# Altium schematic sheet lv_controller.SchDoc
size A4; SheetNumber: 1; SheetTotal: 3; SPICEModelCacheMFLOWQJR: <root> / <DocumentId>MFLOWQJR</DocumentId> / <CacheFrame Number="0"> / <Model Name="skydiode" Kind="MDL"> / <Text>*Default Schottky Diode / *Schottky Diode Pinout: A,K / .MODEL SKYDIODE D(EG=0.69 XTI=2)</Text> / </Model> / </CacheFrame> / </root>
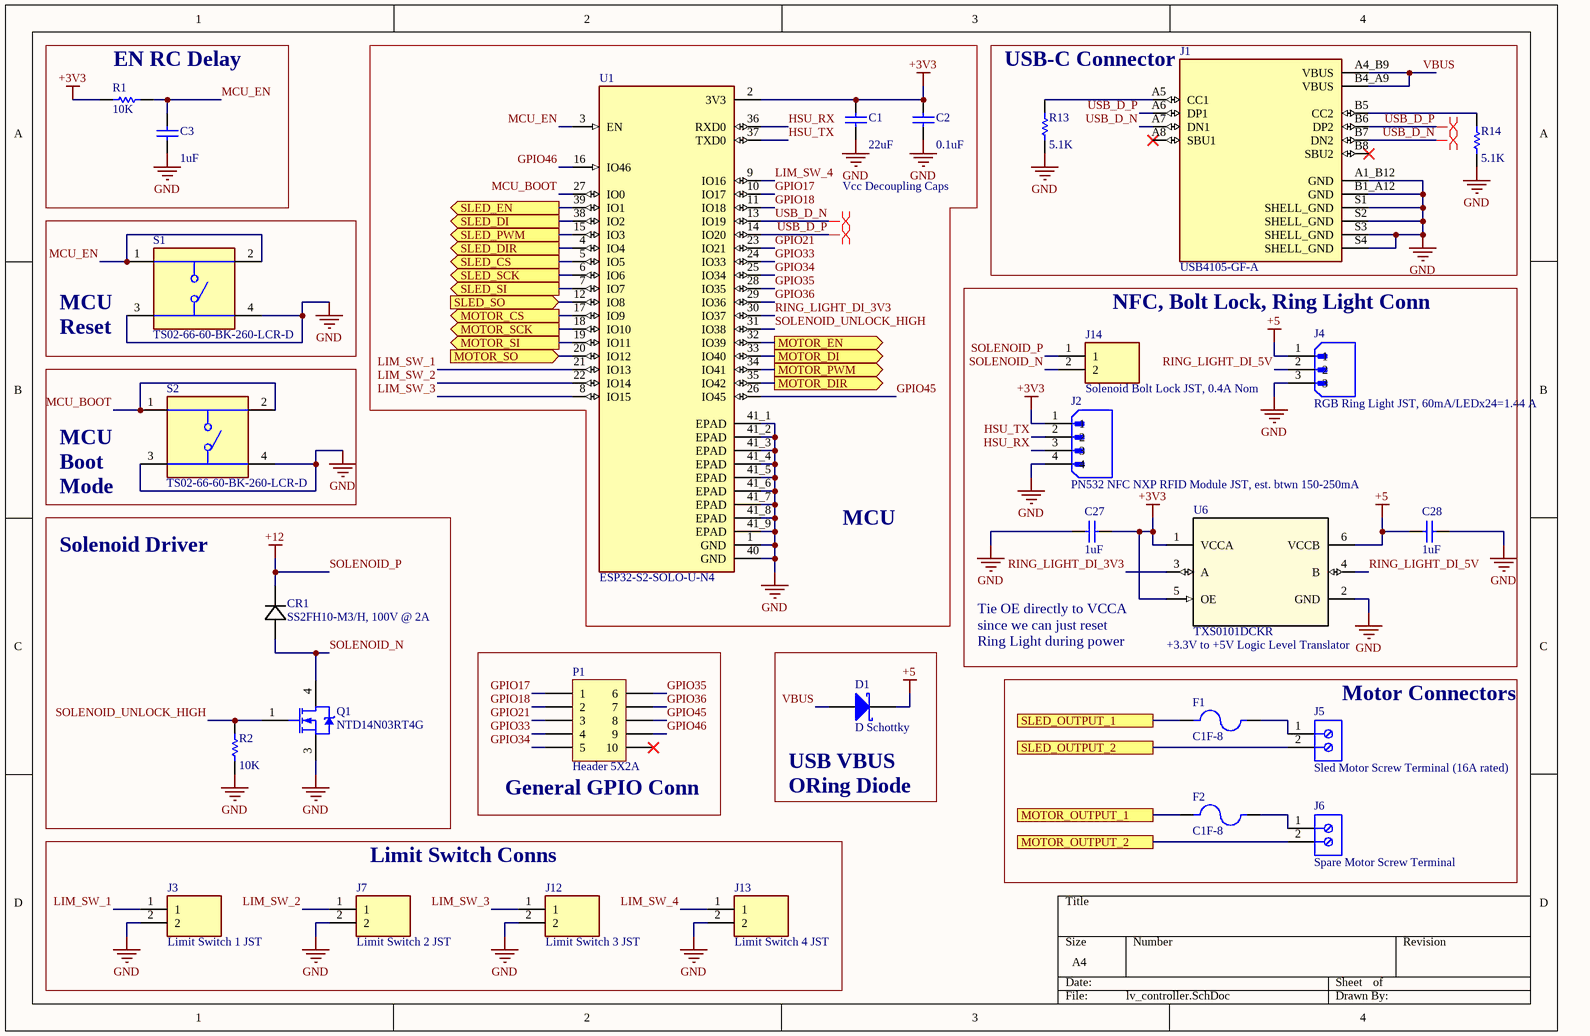
[diagram p0: lv_controller.SchDoc]

## Parts
C1  value 22uF  [C0805]  (hidden comment: Cap)
C2  value 0.1uF  [C0805]  (hidden comment: Cap)
C3  value 1uF  [C0805]  (hidden comment: Cap)
C27  value 1uF  [C0805]  (hidden comment: Cap)
C28  value 1uF  [C0805]  (hidden comment: Cap)
CR1  SS2FH10-M3/H, 100V @ 2A  [CR_10-M3/H_VIS]
D1  D Schottky  [SODFL4725X110N]
F1  C1F-8  [FUSC3215X83N]
F2  C1F-8  [FUSC3215X83N]
J1  USB4105-GF-A  [GCT_USB4105-GF-A]
J2  PN532 NFC NXP RFID Module JST, est. btwn 150-250mA  [JST_B4B-XH-A(LF)(SN)]
J3  Limit Switch 1 JST  [JST_B2B-XH-A(LF)(SN)]
J4  RGB Ring Light JST, 60mA/LEDx24=1.44 A  [JST_B3B-XH-A(LF)(SN)]
J5  Sled Motor Screw Terminal (16A rated)  [PHOE-1725656-2]
J6  Spare Motor Screw Terminal  [PHOE-1725656-2]
J7  Limit Switch 2 JST  [JST_B2B-XH-A(LF)(SN)]
J12  Limit Switch 3 JST  [JST_B2B-XH-A(LF)(SN)]
J13  Limit Switch 4 JST  [JST_B2B-XH-A(LF)(SN)]
J14  Solenoid Bolt Lock JST, 0.4A Nom  [JST_B2B-XH-A(LF)(SN)]
P1  Header 5X2A  [HDR2X5_CEN]
Q1  NTD14N03RT4G  [ONSC-DPAK-3-369C-01_V]
R1  value 10K  [6-0805_M]  (hidden comment: Res1)
R2  value 10K  [6-0805_M]  (hidden comment: Res1)
R13  value 5.1K  [6-0805_M]  (hidden comment: Res1)
R14  value 5.1K  [6-0805_M]  (hidden comment: Res1)
S1  TS02-66-60-BK-260-LCR-D  [SW_TS02-66-60-BK-260-LCR-D]
S2  TS02-66-60-BK-260-LCR-D  [SW_TS02-66-60-BK-260-LCR-D]
U1  ESP32-S2-SOLO-U-N4  [XCVR_ESP32-S2-SOLO-U-N4R2]
U6  TXS0101DCKR  [DCK0006A_N]

## Blocks framed on the sheet
EN RC Delay: C3 R1
MCU: C1 C2 U1
USB-C Connector: J1 R13 R14
NFC, Bolt Lock, Ring Light Conn: C27 C28 J2 J4 J14 U6
Solenoid Driver: CR1 Q1 R2
General GPIO Conn: P1
Motor Connectors: F1 F2 J5 J6
Limit Switch Conns: J3 J7 J12 J13

## Ports
MOTOR_CS (out, see lv_controller_motor_drivers[1C]), MOTOR_DI (out, see lv_controller_motor_drivers[1D]), MOTOR_DIR (out, see lv_controller_motor_drivers[1C]), MOTOR_EN (out, see lv_controller_motor_drivers[1C]), MOTOR_OUTPUT_1 (see lv_controller_motor_drivers[2C]), MOTOR_OUTPUT_2 (see lv_controller_motor_drivers[2C]), MOTOR_PWM (out, see lv_controller_motor_drivers[1C]), MOTOR_SCK (out, see lv_controller_motor_drivers[1C]), MOTOR_SI (out, see lv_controller_motor_drivers[1C]), MOTOR_SO (in, see lv_controller_motor_drivers[1C]), SLED_CS (out, see lv_controller_motor_drivers[2A]), SLED_DI (out, see lv_controller_motor_drivers[2B]), SLED_DIR (out, see lv_controller_motor_drivers[2B]), SLED_EN (out, see lv_controller_motor_drivers[2B]), SLED_OUTPUT_1 (see lv_controller_motor_drivers[4A]), SLED_OUTPUT_2 (see lv_controller_motor_drivers[4A]), SLED_PWM (out, see lv_controller_motor_drivers[2B]), SLED_SCK (out, see lv_controller_motor_drivers[2A]), SLED_SI (out, see lv_controller_motor_drivers[2A]), SLED_SO (in, see lv_controller_motor_drivers[2A])

## Nets
+3V3: C1.2 C2.2 C27.1 J2.1 R1.1 U1.2(3V3) U6.1(VCCA) U6.5(OE)
+5: C28.2 D1.2(K) J4.1 U6.6(VCCB)
GND: C1.1 C2.1 C3.1 C27.2 C28.1 J1.A1_B12(GND) J1.B1_A12(GND) J1.S1(SHELL_GND) J1.S2(SHELL_GND) J1.S3(SHELL_GND) J1.S4(SHELL_GND) J2.4 J3.2 J4.3 J7.2 J12.2 J13.2 Q1.3(S) R2.2 R13.1 R14.1 S1.3 S1.4 S2.3 S2.4 U1.1(GND) U1.40(GND) U1.41_1(EPAD) U1.41_2(EPAD) U1.41_3(EPAD) U1.41_4(EPAD) U1.41_5(EPAD) U1.41_6(EPAD) U1.41_7(EPAD) U1.41_8(EPAD) U1.41_9(EPAD) U6.2(GND)
SOLENOID_P: CR1.1 J14.1  [also labelled +12]
GPIO17: P1.1 U1.10(IO17)
GPIO18: P1.2 U1.11(IO18)
GPIO21: P1.3 U1.23(IO21)
GPIO33: P1.4 U1.24(IO33)
GPIO34: P1.5 U1.25(IO34)
GPIO35: P1.6 U1.28(IO35)
GPIO36: P1.7 U1.29(IO36)
GPIO45: P1.8 U1.26(IO45)
GPIO46: P1.9 U1.16(IO46)
HSU_RX: J2.3 U1.36(RXD0)
HSU_TX: J2.2 U1.37(TXD0)
LIM_SW_1: J3.1 U1.21(IO13)
LIM_SW_2: J7.1 U1.22(IO14)
LIM_SW_3: J12.1 U1.8(IO15)
LIM_SW_4: J13.1 U1.9(IO16)
MCU_BOOT: S2.1 S2.2 U1.27(IO0)
MCU_EN: C3.2 R1.2 S1.1 S1.2 U1.3(EN)
MOTOR_CS: U1.17(IO9) ; port MOTOR_CS
MOTOR_DI: U1.33(IO40) ; port MOTOR_DI
MOTOR_DIR: U1.35(IO42) ; port MOTOR_DIR
MOTOR_EN: U1.32(IO39) ; port MOTOR_EN
MOTOR_OUTPUT_1: F2.1 ; port MOTOR_OUTPUT_1
MOTOR_OUTPUT_2: J6.2 ; port MOTOR_OUTPUT_2
MOTOR_PWM: U1.34(IO41) ; port MOTOR_PWM
MOTOR_SCK: U1.18(IO10) ; port MOTOR_SCK
MOTOR_SI: U1.19(IO11) ; port MOTOR_SI
MOTOR_SO: U1.20(IO12) ; port MOTOR_SO
RING_LIGHT_DI_3V3: U1.30(IO37) U6.3(A)
RING_LIGHT_DI_5V: J4.2 U6.4(B)
SLED_CS: U1.5(IO5) ; port SLED_CS
SLED_DI: U1.38(IO2) ; port SLED_DI
SLED_DIR: U1.4(IO4) ; port SLED_DIR
SLED_EN: U1.39(IO1) ; port SLED_EN
SLED_OUTPUT_1: F1.1 ; port SLED_OUTPUT_1
SLED_OUTPUT_2: J5.2 ; port SLED_OUTPUT_2
SLED_PWM: U1.15(IO3) ; port SLED_PWM
SLED_SCK: U1.6(IO6) ; port SLED_SCK
SLED_SI: U1.7(IO7) ; port SLED_SI
SLED_SO: U1.12(IO8) ; port SLED_SO
SOLENOID_N: CR1.2 J14.2 Q1.4(D)
SOLENOID_UNLOCK_HIGH: Q1.1(G) R2.1 U1.31(IO38)
USB_D_N: J1.A7(DN1) J1.B7(DN2) U1.13(IO19)
USB_D_P: J1.A6(DP1) J1.B6(DP2) U1.14(IO20)
VBUS: D1.1(A) J1.A4_B9(VBUS) J1.B4_A9(VBUS)
NetF1_2: F1.2 J5.1
NetF2_2: F2.2 J6.1
NetJ1_A5: J1.A5(CC1) R13.2
NetJ1_B5: J1.B5(CC2) R14.2

Not connected (* = marked no-connect by the designer): J1 A8(SBU1)* B8(SBU2)*; P1 10*

## Layout directives
differential pair: USB_D_N, USB_D_P

## Notes on the sheet
- Vcc Decoupling Caps
- (near S1) MCU Reset
- (near S2) MCU Boot Mode
- Tie OE directly to VCCA since we can just reset Ring Light during power up
- (near U6) +3.3V to +5V Logic Level Translator
- (near D1) USB VBUS
  ORing Diode

## Library data of the parts
C1-C3 C27 C28 = Cap: Capacitor; Published: 8-Jun-2000; LatestRevisionDate: 17-Jul-2002; LatestRevisionNote: Re-released for DXP Platform.; PackageReference: RAD-0.3; Publisher: Altium Limited; PackageDescription: Radial Cap, Thru-Hole; 2 Leads; 0.3 in Pin Spacing
CR1 = SS2FH10-M3/H: No Description Available; Mfr_Name: Vishay; Type: DEV; Copyright: Copyright (C) 2022 Ultra Librarian. All rights reserved.; Manufacturer_Part_Number: SS2FH10-M3/H; RefDes: RefDes
D1 = D Schottky: Schottky Diode; Published: 8-Jun-2000; LatestRevisionDate: 17-Jul-2002; LatestRevisionNote: Re-released for DXP Platform.; PackageReference: SMB; Publisher: Altium Limited; PackageDescription: DO-214-AA/SMB; 2 C-Bend Leads; Body 5.3 x 3.6 mm, inc. leads (LxW); Code_JEDEC: DO-214-AA
F1 F2 = C1F-8: C1F 8 (0685F8000-01) | 1206 SMT Fuse | Fast Acting | 8A; MF: Bel Fuse; Availability: Unavailable; Value: *; Price: None; MP: C1F-8; Package: 1206 Bel Fuse; SnapEDA_Link: https://www.snapeda.com/parts/C1F-8/Bel%20Fuse/view-part/4620009/?ref=snap; Check_prices: https://www.snapeda.com/parts/C1F-8/Bel%20Fuse/view-part/4620009/?ref=eda
J1 = USB4105-GF-A: USB-C (USB TYPE-C) USB 2.0 Receptacle Connector 24 (16+8 Dummy) Position Surface Mount, Right Angle; Through Hole; MF: GCT; Price: None; Availability: In Stock; MP: USB4105-GF-A; Package: None; SnapEDA_Link: https://www.snapeda.com/parts/USB4105-GF-A/Global+Connector+Technology/view-part/?ref=snap; Check_prices: https://www.snapeda.com/parts/USB4105-GF-A/Global+Connector+Technology/view-part/?ref=eda; Value: *; Purchase-URL: https://pricing.snapeda.com/search/part/USB4105-GF-A/?ref=eda
J2 = B4B-XH-A(LF)(SN): Price: None; MP: B4B-XH-A(LF)(SN); Value: *; Availability: Unavailable; Package: None
J3 J7 J12-J14 = B2B-XH-A(LF)(SN): Connector Header Through Hole 2 position 0.098 (2.50mm); MF: JST Sales; MP: B2B-XH-A(LF)(SN); Package: None; SnapEDA_Link: https://www.snapeda.com/parts/B2B-XH-A(LF)(SN)/JST+Sales+America+Inc./view-part/?ref=snap; Purchase-URL: https://pricing.snapeda.com/search/part/B2B-XH-A(LF)(SN)/?ref=eda; Check_prices: https://www.snapeda.com/parts/B2B-XH-A(LF)(SN)/JST+Sales+America+Inc./view-part/?ref=eda; Availability: In Stock; Value: *; Price: None
J4 = B3B-XH-A(LF)(SN): Value: *; MP: B3B-XH-A(LF)(SN); Availability: Unavailable; Package: None; Price: None
J5 J6 = CMP-2000-05299-1: Male Header, Pitch 2.54 mm, 1 x 2 Position, Height 9 mm, Tail Length 3.5 mm; Manufacturer part No.: 1725656; Manufacturer: Phoenix Contact; Number of contacts: 2; Content: 250pc(s); Pitch: 2.54mm; Industrial packaging: Yes; Colour: Green; Type: MPT0,5/2-2,54; Datasheet URL: http://datasheet.octopart.com/1725656-Phoenix-Contact-datasheet-5302866.pdf; Manufacturer URL: http://www.phoenixcontact.com/; Datasheet Version: Apr-08
P1 = Header 5X2A: Header, 5-Pin, Dual row; LatestRevisionDate: 17-Jul-2002; LatestRevisionNote: Re-released for DXP Platform.; Publisher: Altium Limited
Q1 = CMP-1058-00361-1: Power MOSFET, 14 A, 25 V, N-Channel, 3-Pin DPAK, Pb-Free, Tape and Reel; Manufacturer: On Semiconductor; Configuration: Single; Ciss Typ (pF): 115; Coss Typ (pF): 62; VGS(th) Max (V): 2; Channel Polarity: N Channel; Crss Typ (pF): 33; V(BR)DSS Min (V): 25; VGS Max (V): 20; PackageVersion: Rev. E, 02/2014; RoHS: Pb-Free; ComponentLink2URL: http://www.onsemi.cn/pub_link/Collateral/NTD14N03R-D.PDF; ComponentLink1URL: http://www.onsemi.com/; PackageDescription: 3-Pin Flange Mount, Body 6.54 x 6.095 mm, Pitch 2.29 mm; Package Type: DPAK-3; ComponentLink1Description: Manufacturer URL; Qrr Typ (nC): 2; ComponentLink3URL: http://www.onsemi.cn/pub_link/Collateral/369C.PDF; PackageReference: DPAK-3-369C-01; ComponentLink2Description: Datasheet; DatasheetVersion: Rev. 7; Mounting Technology: Surface Mount; ComponentLink3Description: Package Specification; PartNumber: NTD14N03RT4G; Packing: Tape and Reel
R1 R2 R13 R14 = Res1: Resistor; Published: 8-Jun-2000; LatestRevisionDate: 17-Jul-2002; LatestRevisionNote: Re-released for DXP Platform.; PackageReference: AXIAL-0.3; Publisher: Altium Limited; PackageDescription: Axial Device, Thru-Hole; 2 Leads; 0.3 in Pin Spacing
S1 S2 = TS02-66-60-BK-260-LCR-D: 6 x 6 mm, 6 mm Actuator Height, 260 gf, Black, Long Crimped, Through Hole, SPST, Tactile Switch; MF: CUI Devices; Check_prices: https://www.snapeda.com/parts/TS02-66-60-BK-260-LCR-D/CUI+Devices/view-part/?ref=eda; Price: None; SnapEDA_Link: https://www.snapeda.com/parts/TS02-66-60-BK-260-LCR-D/CUI+Devices/view-part/?ref=snap; Availability: In Stock; Value: *; CUI_purchase_URL: https://www.cuidevices.com/product/switches/tactile-switches/ts02-series?utm_source=snapeda.com&utm_medium=referral&utm_campaign=snapedaBOM; MP: TS02-66-60-BK-260-LCR-D; Purchase-URL: https://pricing.snapeda.com/search/part/TS02-66-60-BK-260-LCR-D/?ref=eda; Package: None
U1 = ESP32-S2-SOLO-U-N4R2: WiFi 802.11b/g/n Transceiver Module 2.4GHz PCB Trace + IPEX Surface Mount; MF: Espressif Systems; Package: SMD-40 Espressif Systems; Check_prices: https://www.snapeda.com/parts/ESP32-S2-SOLO-U-N4R2/Espressif+Systems/view-part/?ref=eda; Availability: In Stock; Value: *; MP: ESP32-S2-SOLO-U-N4R2; Purchase-URL: https://pricing.snapeda.com/search/part/ESP32-S2-SOLO-U-N4R2/?ref=eda; SnapEDA_Link: https://www.snapeda.com/parts/ESP32-S2-SOLO-U-N4R2/Espressif+Systems/view-part/?ref=snap; Price: None
U6 = TXS0101DCKR: No Description Available; Mfr_Name: Texas Instruments; Type: DEV; RefDes: RefDes; Copyright: Copyright (C) 2022 Ultra Librarian. All rights reserved.; Manufacturer_Part_Number: TXS0101DCKR